# EAGLE design ESP8266 Thermometer (EAGLE 9.6.2)
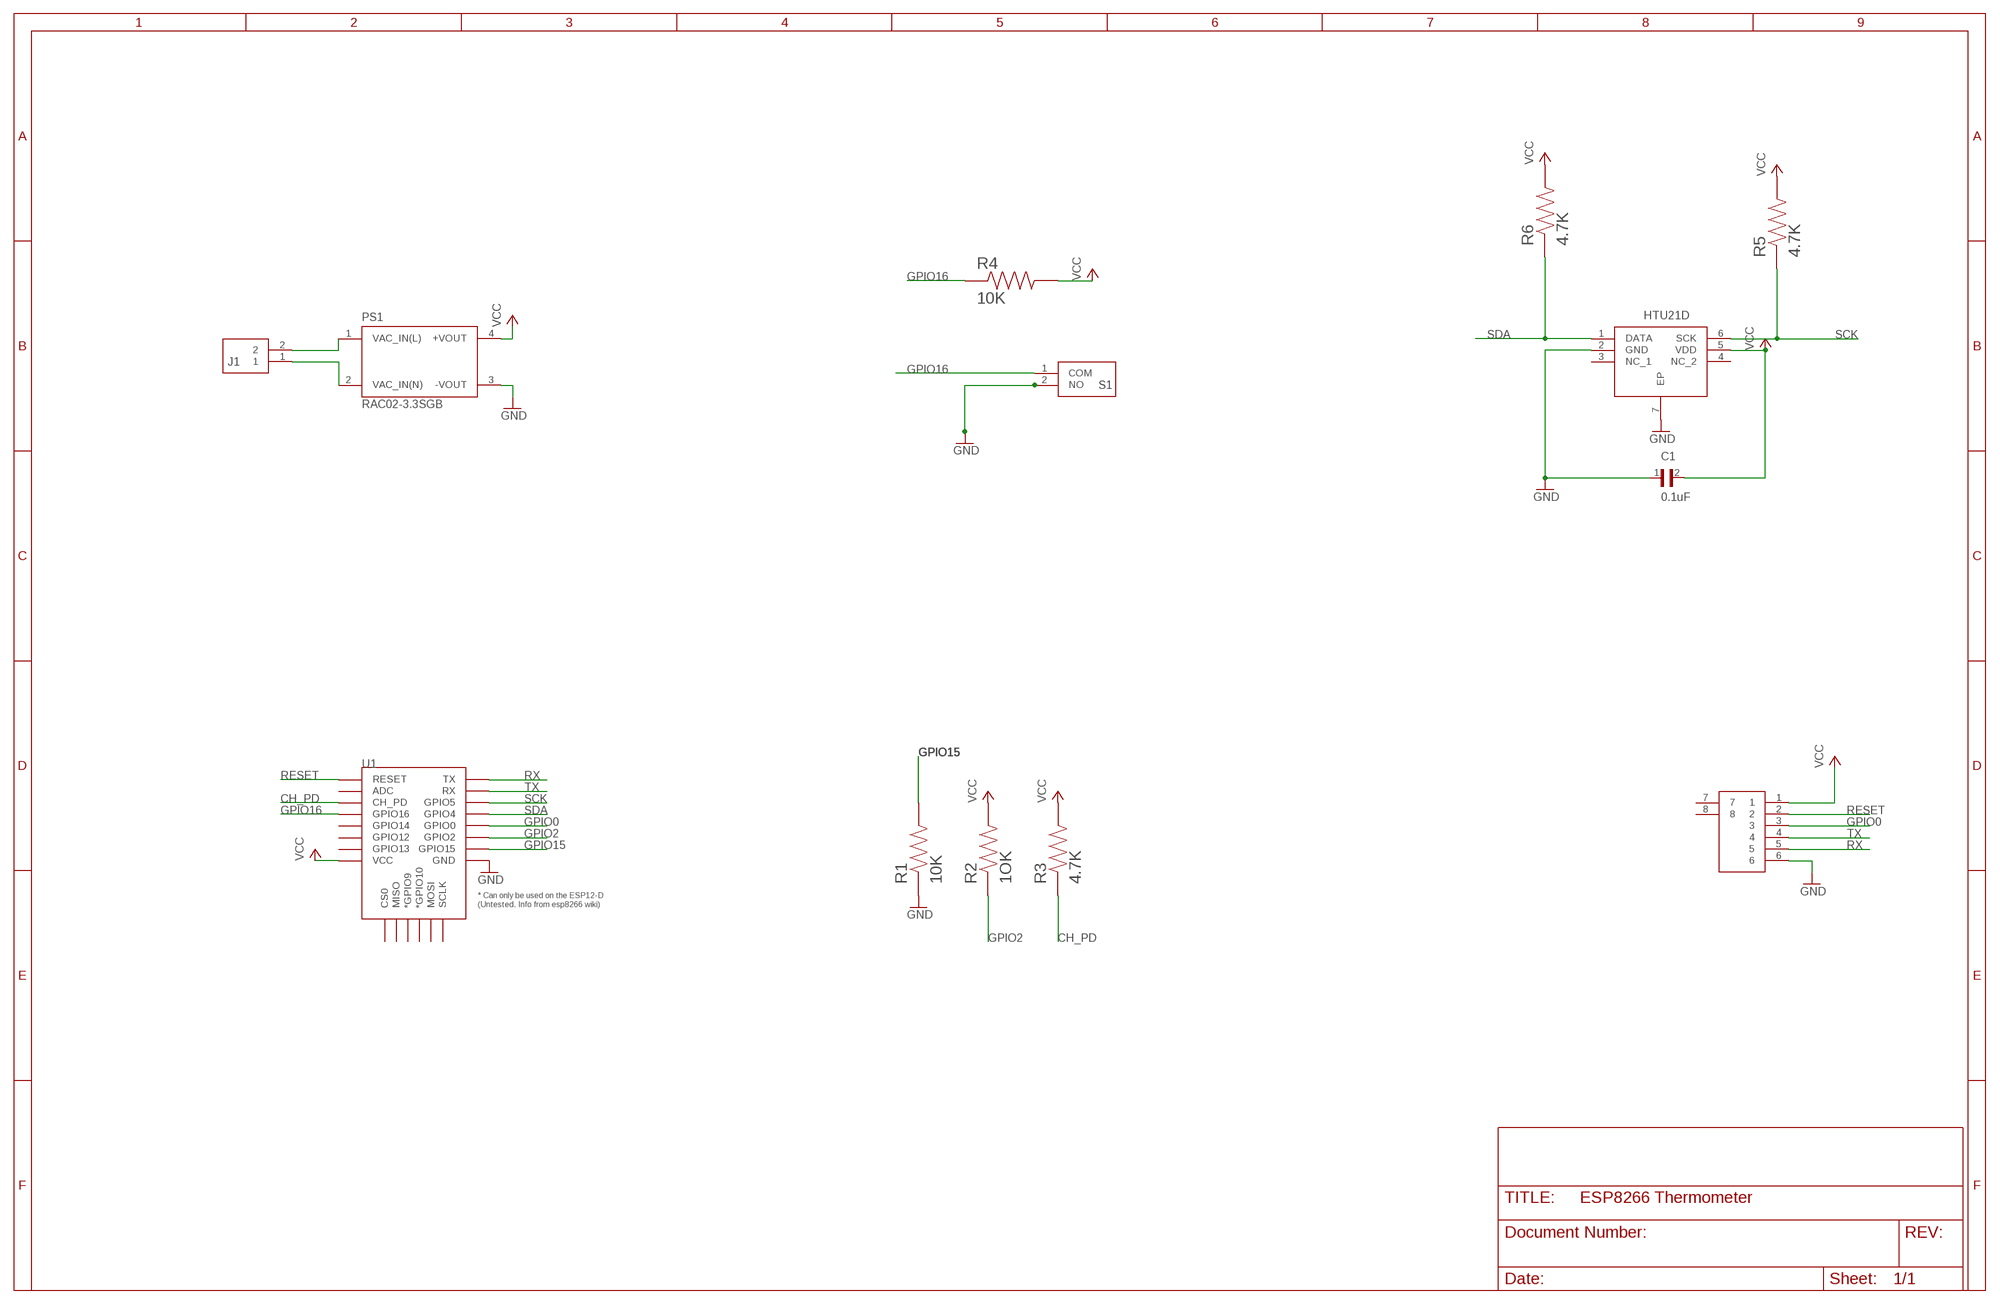
[diagram p0: schematic, sheet 1]

## Parts
C1  0.1uF  0805YC103J4T2A  [CAPC2012X94N]
HM1  HTU21D  [SON100P300X300X100-7N]
J1  TB006-508-02BE  [TB00650802BE]
J2  52852-0670  [528520670]
PS1  RAC02-3.3SGB  [CONV_RAC02-3.3SGB]
R1  10K  RC0805FR-07330RL  [RESC2012X60N]
R2  1OK  RC0805FR-07330RL  [RESC2012X60N]
R3  4.7K  RC0805FR-07330RL  [RESC2012X60N]
R4  10K  RC0805FR-07330RL  [RESC2012X60N]
R5  4.7K  RC0805FR-07330RL  [RESC2012X60N]
R6  4.7K  RC0805FR-07330RL  [RESC2012X60N]
S1  PTS636_SP50_SMTR_LFS  [PTS636SP50SMTRLFS]
U1  ESP12ESMD  [ESP12E-SMD]

## Nets
CH_PD: R3.1 U1.CH_PD
GND: C1.1 HM1.2(GND) HM1.7(EP) J2.6 PS1.3(-VOUT) R1.1 S1.2(NO) U1.GND
GPIO0: J2.3 U1.GPIO0
GPIO2: R2.1 U1.GPIO2
GPIO15: R1.2 U1.GPIO15
GPIO16: R4.1 S1.1(COM) U1.GPIO16
N$1: J1.2 PS1.1(VAC_IN(L))
N$2: J1.1 PS1.2(VAC_IN(N))
RESET: J2.2 U1.RESET
RX: J2.5 U1.TXD0(TX)
SCK: HM1.6(SCK) R5.1 U1.GPIO5
SDA: HM1.1(DATA) R6.1 U1.GPIO4
TX: J2.4 U1.RXD0(RX)
VCC: C1.2 HM1.5(VDD) J2.1 PS1.4(+VOUT) R2.2 R3.2 R4.2 R5.2 R6.2 U1.VCC
Unconnected: HM1.3(NC_1) HM1.4(NC_2) J2.7 J2.8 U1.ADC U1.CS0 U1.GPIO9(*GPIO9) U1.GPIO10(*GPIO10) U1.GPIO12 U1.GPIO13 U1.GPIO14 U1.MISO U1.MOSI U1.SCLK

## Library data of the parts
C1 = 0805YC103J4T2A:0805YC103J4T2A: Cap Ceramic 0.01uF 16V X7R 5% SMD 0805 125°C Paper T/R Check availability <https://pricing.snapeda.com/parts/0805YC103J4T2A/AVX/view-part?ref=eda>; AVAILABILITY: In Stock; DESCRIPTION: 10000 pF ±5% 16V Ceramic Capacitor X7R 0805 (2012 Metric); MF: AVX; MP: 0805YC103J4T2A; PACKAGE: 2012 AVX; PRICE: None; PURCHASE-URL: https://pricing.snapeda.com/search/part/0805YC103J4T2A/?ref=eda
HM1 = HTU21D:HTU21D: SENSOR SOLUTIONS - TE CONNECTIVITY - HTU21D - HUMIDITY/TEMP SENSOR, DIGITAL, DFN-6 Source: Datasheet <http://www.te.com/commerce/DocumentDelivery/DDEController?Action=showdoc&DocId=Data SheetHPC199_6A6pdfEnglishENG_DS_HPC199_6_A6.pdfCAT-HSC0004>; DESCRIPTION: SENSOR SOLUTIONS - TE CONNECTIVITY - HTU21D - HUMIDITY/TEMP SENSOR, DIGITAL, DFN-6; HEIGHT: 1mm; MANUFACTURER_NAME: TE Connectivity; MANUFACTURER_PART_NUMBER: HTU21D; MOUSER_PART_NUMBER: 824-HTU21D; MOUSER_PRICE-STOCK: https://www.mouser.co.uk/ProductDetail/Measurement-Specialties/HTU21D?qs=tx5doIiTu8oixw1WN5Uy8A%3D%3D
J1 = TB006-508-02BE:TB006-508-02BE: Fixed Terminal Blocks screw type, 5.08 , horizontal, 2 poles, CUI Blue, slotted screw, PCB mount Source: Datasheet; DESCRIPTION: Fixed Terminal Blocks screw type, 5.08 , horizontal, 2 poles, CUI Blue, slotted screw, PCB mount; HEIGHT: 10.4mm; MANUFACTURER_NAME: CUI Inc.; MANUFACTURER_PART_NUMBER: TB006-508-02BE; MOUSER_PART_NUMBER: 490-TB006-508-02BE; MOUSER_PRICE-STOCK: https://www.mouser.co.uk/ProductDetail/CUI-Devices/TB006-508-02BE?qs=vLWxofP3U2wEdOVV%2FaT04w%3D%3D
J2 = 52852-0670:52852-0670: FFC & FPC Connectors 1.0 FFC Non ZIF SMT HsgAssy6CktEmbsTpPkg Source: Datasheet <https://www.molex.com/pdm_docs/sd/528520670_sd.pdf>; DESCRIPTION: FFC & FPC Connectors 1.0 FFC Non ZIF SMT HsgAssy6CktEmbsTpPkg; HEIGHT: 3mm; MANUFACTURER_NAME: Molex; MANUFACTURER_PART_NUMBER: 52852-0670; MOUSER_PART_NUMBER: 538-52852-0670; MOUSER_PRICE-STOCK: https://www.mouser.co.uk/ProductDetail/Molex/52852-0670?qs=%252BdbFUiYBkDZQc5IPgvIwgQ%3D%3D
PS1 = RAC02-3.3SGB:RAC02-3.3SGB: AC/DC Converter, 2 Watt, Single Output, EMC Class B Check prices <https://pricing.snapeda.com/parts/RAC02-3.3SGB/Recom%20Power/view-part?ref=eda>; DESCRIPTION: 2W AC/DC-Converter 'POWERLINE' 3kV reg; MF: Recom Power; MP: RAC02-3.3SGB; PACKAGE: DIP-4 Recom Power; PRICE: None
R1-R6 = RC0805FR-07330RL:RC0805FR-07330RL: Resistor SMD [YAGEO] RC0805FR-07330RL Resistor SMD Check availability <https://pricing.snapeda.com/parts/RC0805FR-07330RL/Yageo/view-part?ref=eda>; AVAILABILITY: In Stock; DESCRIPTION: 330 Ohms ±1% 0.125W, 1/8W Chip Resistor 0805 (2012 Metric) Moisture Resistant Thick Film; MF: Yageo; MP: RC0805FR-07330RL; PACKAGE: 2012 Rohm Semiconductor; PRICE: None; PURCHASE-URL: https://pricing.snapeda.com/search/part/RC0805FR-07330RL/?ref=eda
S1 = PTS636_SP50_SMTR_LFS:PTS636_SP50_SMTR_LFS: Tactile Switches Tact 50mA 12VDC, 6.0x3.5, 5.0mm H, 320gf, G leads, No ground pin, Black Actuator Source: Datasheet <https://componentsearchengine.com/Datasheets/1/PTS636 SP50 SMTR LFS.pdf>; DESCRIPTION: Tactile Switches Tact 50mA 12VDC, 6.0x3.5, 5.0mm H, 320gf, G leads, No ground pin, Black Actuator; HEIGHT: 5.2mm; MANUFACTURER_NAME: C & K COMPONENTS; MANUFACTURER_PART_NUMBER: PTS636 SP50 SMTR LFS; MOUSER_PART_NUMBER: 611-PTS636SP50SMTRLF; MOUSER_PRICE-STOCK: https://www.mouser.co.uk/ProductDetail/CK/PTS636-SP50-SMTR-LFS/?qs=vLWxofP3U2yQrwr1QnrRJw%3D%3D
U1 = esp8266modules:ESP12E: ESP12E Module

## Board
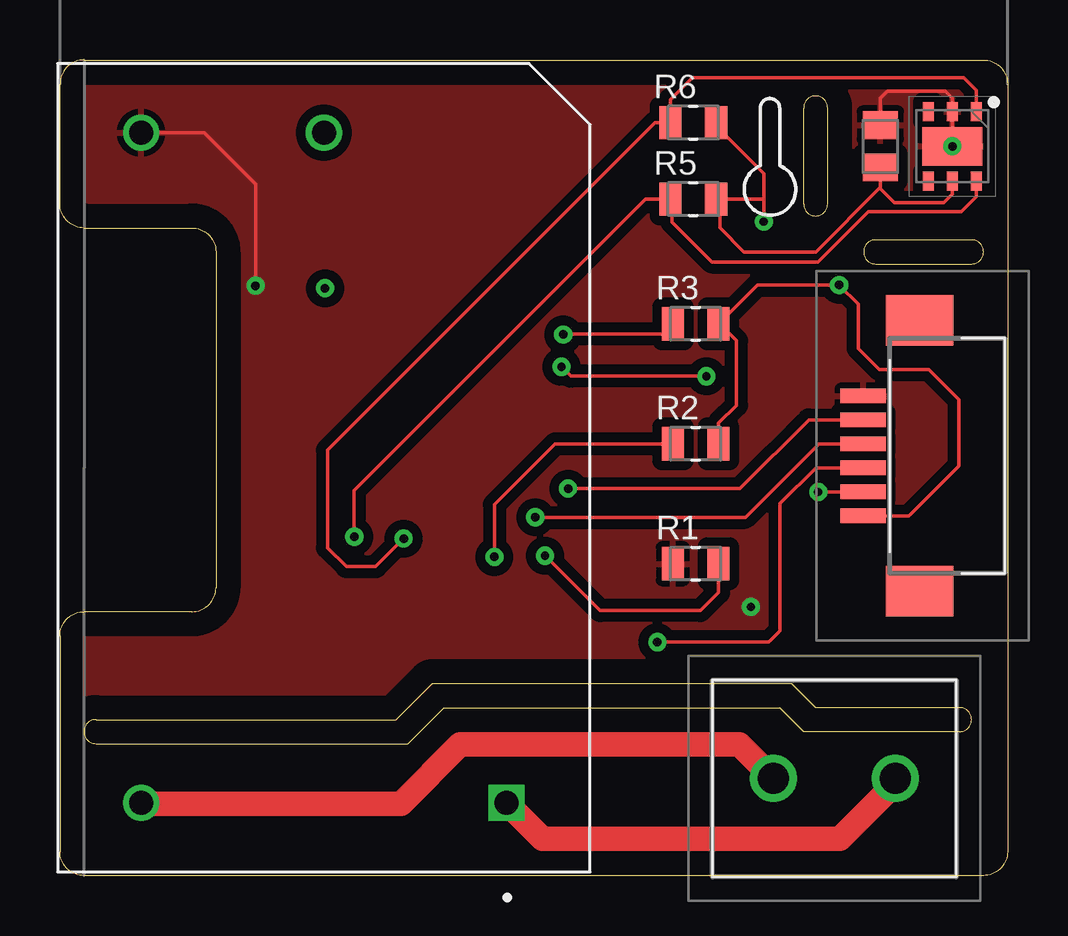
[diagram p1: board, top side]
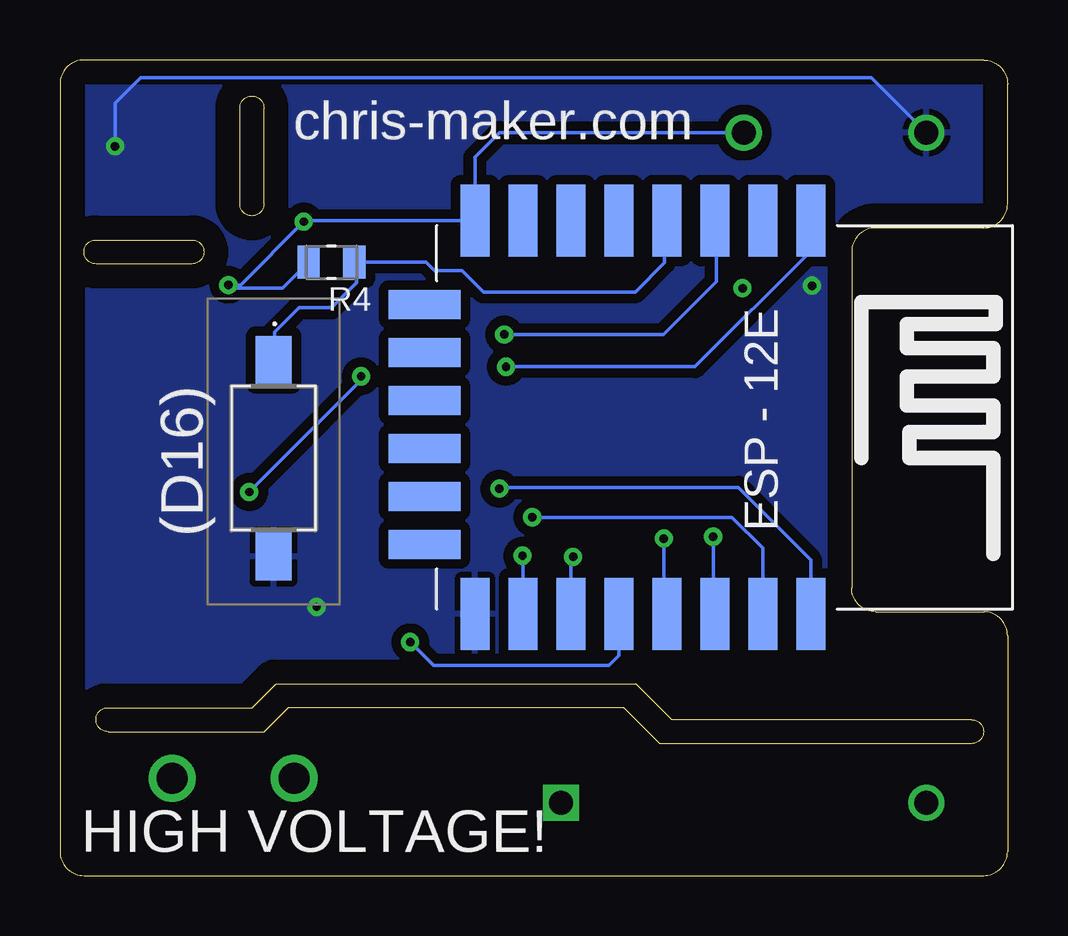
[diagram p2: board, bottom side, seen from below]

Size 39.5 x 34 mm. Coordinates in mm from the lower left corner, seen from the top.
Outline: 1,34 38.5,34 arc-90 39.5,33 39.5,1 arc-90 38.5,0 1,0 arc-90 0,1 0,10 arc-90 1,11 5.5,11 arc90 6.5,12 6.5,26 arc90 5.5,27 1,27 arc-90 0,28 0,33 arc-90 1,34
Outline: 16,7 30,7 31,6 37.5,6 arc90 38,6.5 arc90 37.5,7 31.5,7 30.5,8 15.5,8 14,6.5 1.5,6.5 arc90 1,6 arc90 1.5,5.5 14.5,5.5 16,7
Outline: 31,28 arc90 31.5,27.5 arc90 32,28 32,32 arc90 31.5,32.5 arc90 31,32 31,28
Outline: 38.5,26 arc90 38,26.5 34,26.5 arc90 33.5,26 arc90 34,25.5 38,25.5 arc90 38.5,26
Copper layers (1*16): Top 0.035mm / dielectric 1.5mm / Bottom 0.035mm
Design rules "untitled": minimum track width 6mil, minimum drill 0.35mm, track to track 0.205mm, track to pad 0.205mm, pad to pad 0.205mm, via to via 0.205mm, smd to smd 6mil, copper to edge 40mil, drill to drill 6mil, minimum pad ring 10mil, minimum via ring 8mil, stop-mask expansion 4mil, vias tented up to drill 0mil, thermal gap 10mil

### Footprints (pad centres in the part's own frame; a part is rotated, then mirrored left to right if it is on the bottom)
CAPC2012X94N = smd 1.16 x 1.47: 1 -0.88,0; 2 0.88,0
SON100P300X300X100-7N = smd 0.8 x 0.45: 1 -1.45,1; 2 -1.45,0; 3 -1.45,-1; 4 1.45,-1; 5 1.45,0; 6 1.45,1 | smd 1.6 x 2.5: 7 0,0
TB00650802BE = drill 1.3 pad 1.95: 1 0,0; 2 5.08,0
528520670 = smd 0.6 x 1.9: 1 -2.5,2.475; 2 -1.5,2.475; 3 -0.5,2.475; 4 0.5,2.475; 5 1.5,2.475; 6 2.5,2.475 | smd 2.1 x 2.8: 7 -5.65,0.125; 8 5.65,0.125
CONV_RAC02-3.3SGB = drill 1 pad 1.5 square: 1 -13.97,-7.62 | drill 1 pad 1.5: 2 -13.97,7.62; 3 13.97,7.62; 4 13.97,0
RESC2012X60N = smd 0.92 x 1.38: 1 -0.955,0; 2 0.955,0
PTS636SP50SMTRLFS = smd 2 x 1.5: 1 -4.1,0; 2 4.1,0
ESP12E-SMD = smd 3 x 1.2: ADC -8.3,3.8; CH_PD -8.3,1.8; GND 8.1,-8.2; GPIO0 8.1,-2.2; GPIO2 8.1,-4.2; GPIO4 8.1,-0.2; GPIO5 8.1,1.8; GPIO12 -8.3,-4.2; GPIO13 -8.3,-6.2; GPIO14 -8.3,-2.2; GPIO15 8.1,-6.2; GPIO16 -8.3,-0.2; RESET -8.3,5.8; RXD0 8.1,3.8; TXD0 8.1,5.8; VCC -8.3,-8.2 | smd 1.2 x 3: CS0 -4.8,-10.3; GPIO9 -0.8,-10.3; GPIO10 1.2,-10.3; MISO -2.8,-10.3; MOSI 3.2,-10.3; SCLK 5.2,-10.3

### Placement (x,y rotation side)
C1  34.2,30.4 270 top
HM1  37.2,30.4 270 top
J1  29.74,4.05 0 top
J2  35.96,17.5 90 top
PS1  11,17 90 top
R1  26.5,13 0 top
R2  26.5,18 0 top
R3  26.5,23 0 top
R4  28.18,25.57 180 bottom
R5  26.4,28.2 0 top
R6  26.4,31.39 0 top
S1  30.6,17.4 270 bottom
U1  14,19 270 bottom

### Tracks (layer width: path | path; a pad name or v marks a point on that pad's centre or on a via)
CH_PD  (via drill 0.35)
  Top 0.152: R3.1 25.48,22.58 21.01,22.58 v20.98,22.55
  Bottom 0.152: v20.98,22.55 14.35,22.55 12.14,24.77 12.14,27.24 U1.CH_PD
GND  (via drill 0.35)
  Top 0.152: C1.1 34.2,32.4 34.5,32.7 36.9,32.7 37.2,32.4 HM1.2 HM1.7 | PS1.3 6.01,30.97 8.15,28.83 v8.15,24.59
  Bottom 0.152: PS1.3 5.67,33.26 36.14,33.26 37.2,32.2 HM1.7
  other vias: 37.2,30.4 28.8,11.2
  pour Top (isolate 0.406): -1,35 40.5,35 40.5,-1 -1,-1
  pour Bottom (isolate 0.406): -1.72,36 41,36 41,-2 -1.72,-2
GPIO0  (via drill 0.35)
  Top 0.152: J2.3 31.51,17 30.02,15.51 30.02,10.19 29.56,9.73 v24.9,9.73
  Bottom 0.152: 16.2,9.48 U1.GPIO0 16.2,9.19 16.62,8.77 23.94,8.77 v24.9,9.73
GPIO2  (via drill 0.35)
  Top 0.152: v18.11,13.28 18.11,15.46 20.64,18 R2.1
  Bottom 0.152: U1.GPIO2 18.2,13.19 v18.11,13.28
GPIO15  (via drill 0.35)
  Top 0.152: R1.2 27.45,11.8 26.7,11.04 22.51,11.04 v20.22,13.34
  Bottom 0.152: U1.GPIO15 20.2,13.32 v20.22,13.34
GPIO16
  Bottom 0.152: U1.GPIO16 14.3,27.2 14.3,25.55 15.52,24.33 21.84,24.33 22.73,25.22 23.88,25.22 24.23,25.58 27.13,25.58 | 27.13,25.58 27.22,25.58 R4.1 | S1.1 30.56,21.54 30.56,22.66 29.54,23.67 28.17,23.67 27.13,24.71 27.13,25.58
N$1
  Top 1.016: PS1.1 20.12,1.53 32.5,1.53 34.82,3.85 J1.2
N$2
  Top 1.016: PS1.2 3.41,3 14.21,3 16.68,5.47 28.32,5.47 J1.1
N$6  (via drill 0.35)
  other vias: 11.05,24.49
RESET  (via drill 0.35)
  Top 0.152: v26.95,20.82 21.3,20.82 v20.9,21.21 | v31.61,15.99 v31.62,16 J2.2
  Bottom 0.152: U1.RESET 8.2,26.03 13.02,21.21 v20.9,21.21 | v31.61,15.99 26.95,20.65 v26.95,20.82
RX  (via drill 0.35)
  Top 0.152: v21.18,16.13 28.34,16.13 31.21,19 J2.5
  Bottom 0.152: U1.TXD0 8.2,13.15 11.23,16.18 21.13,16.18 v21.18,16.13
SCK  (via drill 0.35)
  Top 0.152: HM1.6 38.2,28.3 37.58,27.67 33.7,27.67 31.6,25.58 27.17,25.58 25.5,27.25 25.5,28.14 R5.1 24.41,28.2 12.27,16.05 v12.27,14.12
  Bottom 0.152: v12.27,14.12 12.27,10.97 U1.GPIO5
SDA  (via drill 0.35)
  Top 0.152: HM1.1 38.2,32.74 37.68,33.26 26.36,33.26 25.45,32.35 R6.1 24.81,31.39 11.15,17.73 11.15,13.66 11.94,12.88 13.16,12.88 v14.33,14.05
  Bottom 0.152: v14.33,14.05 14.33,11.03 U1.GPIO4
TX  (via drill 0.35)
  Top 0.152: v19.81,14.94 28.57,14.94 31.63,18 J2.4
  Bottom 0.152: U1.RXD0 10.2,13.65 11.48,14.94 v19.81,14.94
VCC  (via drill 0.35)
  Top 0.152: HM1.5 37.2,28.4 36.85,28.05 34.78,28.05 34.2,28.63 34.2,28.7 | C1.2 34.2,28.7 | 34.2,28.7 31.5,26 28.51,26 27.5,27.01 27.5,28.05 R5.2 29.34,28.2 v29.34,27.26 29.34,29.26 27.36,31.24 R6.2 27.5,31.24 | R2.2 27.45,18.86 28.2,19.6 28.2,22.3 27.48,23.01 R3.2 29.07,24.62 v32.47,24.62 | v32.47,24.62 v32.48,24.62 | J2.1 35.39,15 37.46,17.07 37.46,19.85 36.21,21.1 34.15,21.1 33.27,21.97 33.27,23.82 v32.47,24.62
  Bottom 0.152: PS1.4 21.18,30.97 22.2,29.95 U1.VCC 29.3,27.3 v29.34,27.26 | v29.34,27.26 29.46,27.26 | R4.2 30.22,24.49 32.35,24.49 v32.48,24.62 31.98,24.62 v29.34,27.26

### Text on the board
bPlace: chris-maker.com | (D16) | HIGH VOLTAGE!